# EAGLE schematic Launchpad Board (EAGLE 7.1.0)
CNAME: Bristol Community College; CREVISION: v1r0; DESIGNER: J. Brian
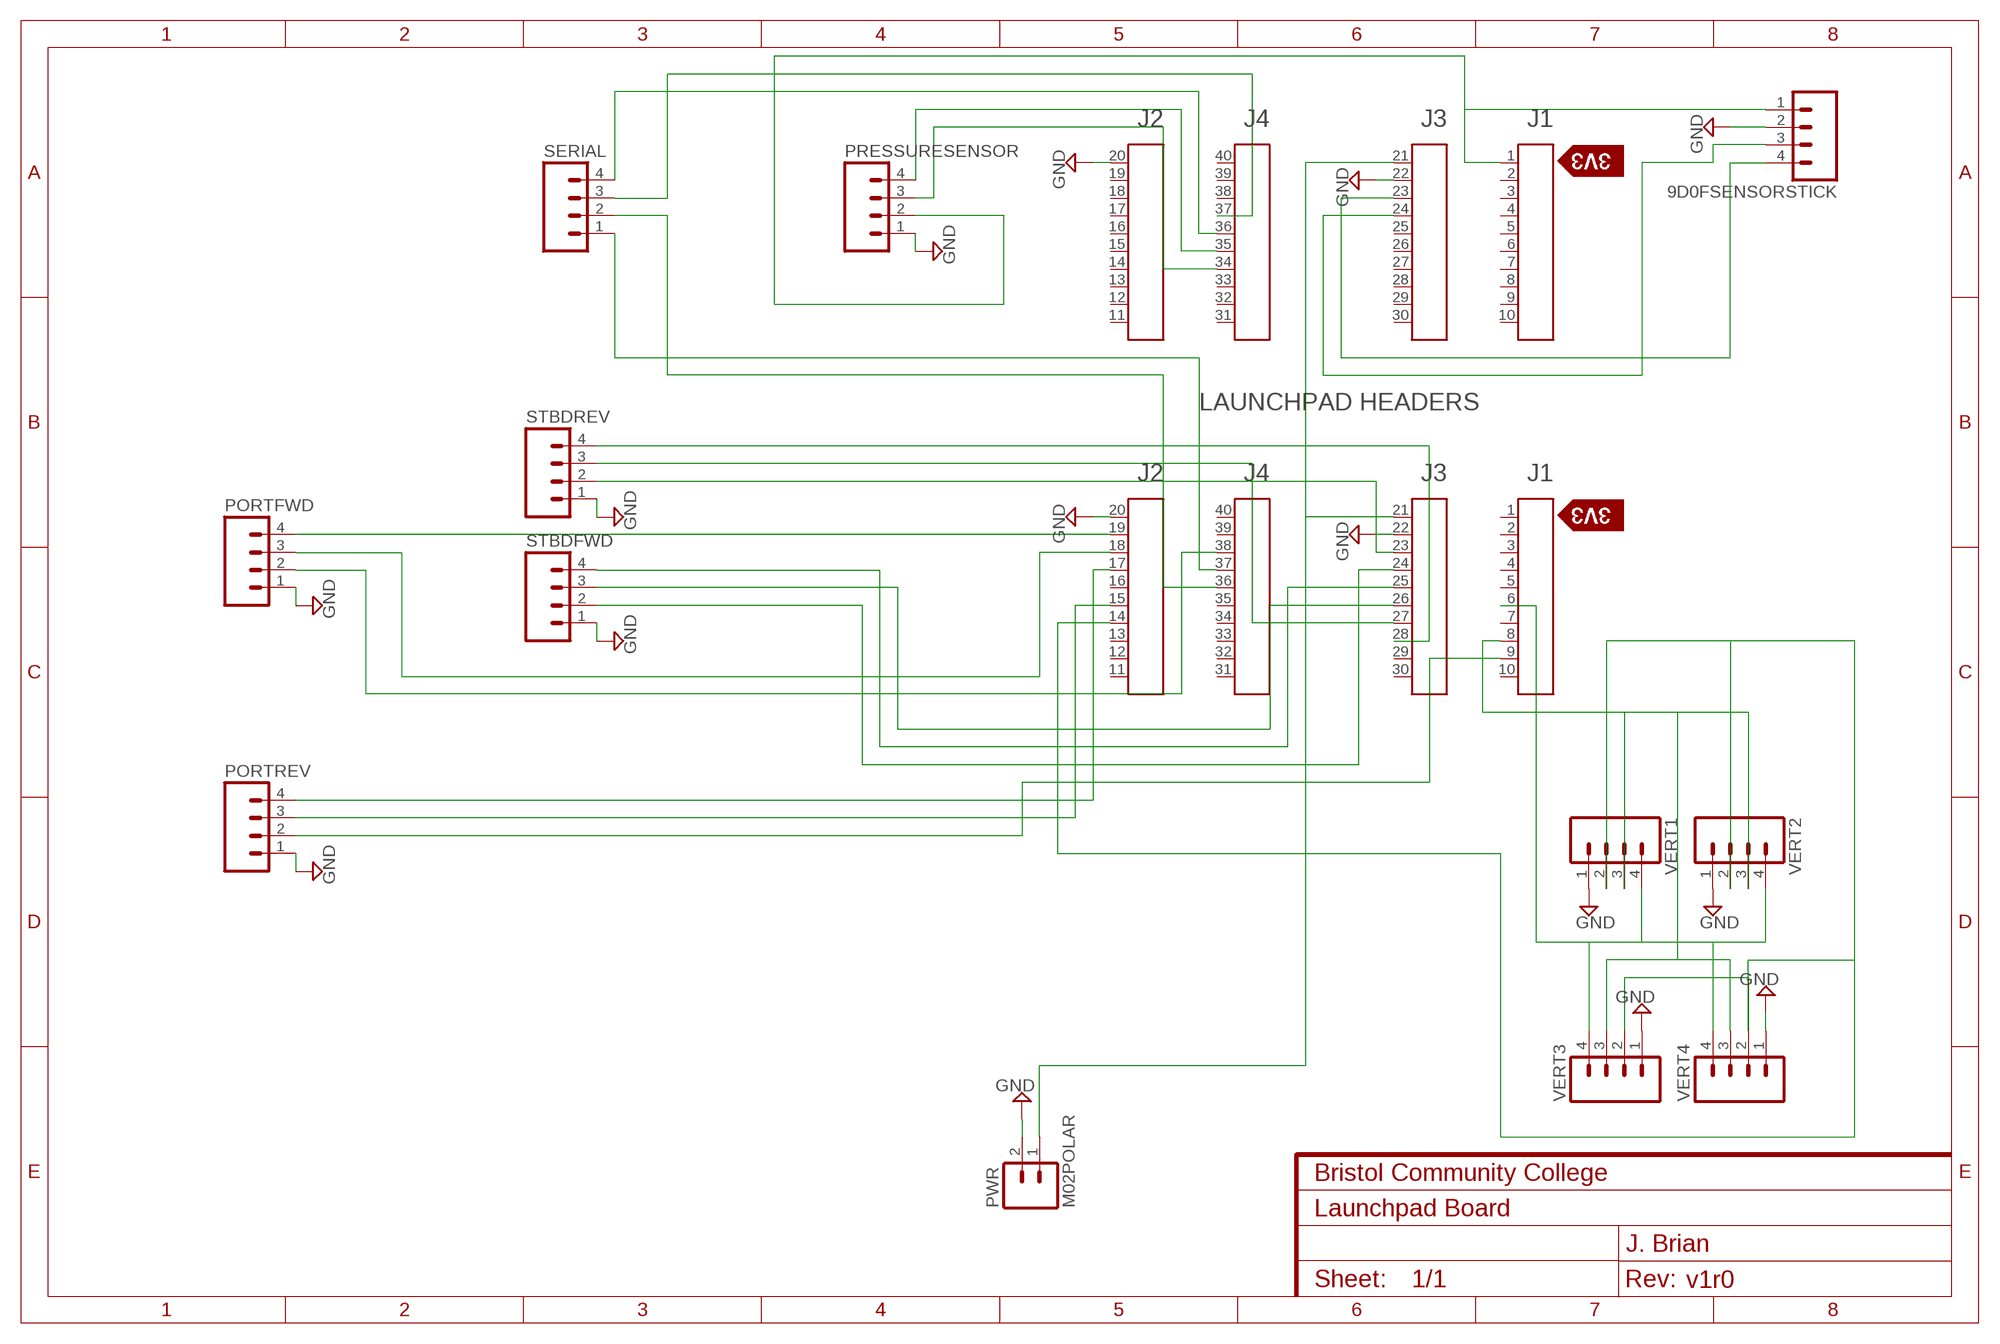
[diagram p0: schematic, sheet 1]

## Parts
9D0FSENSORSTICK  M04PTH  [1X04]
A1  HEADER4X10-BOOSTERPACK  [4X10-BOOSTERPACK]
A2  HEADER4X10-BOOSTERPACK  [4X10-BOOSTERPACK]
PORTFWD  M04POLAR_LOCK  [MOLEX-1X4_LOCK]
PORTREV  M04POLAR_LOCK  [MOLEX-1X4_LOCK]
PRESSURESENSOR  M04POLAR  [MOLEX-1X4]
PWR  M02POLAR  [MOLEX-1X2]
SERIAL  M04POLAR_LOCK  [MOLEX-1X4_LOCK]
STBDFWD  M04POLAR_LOCK  [MOLEX-1X4_LOCK]
STBDREV  M04POLAR_LOCK  [MOLEX-1X4_LOCK]
U$3  SILK_3V3_TAG  [SILK_3V3_TAG]
U$4  SILK_3V3_TAG  [SILK_3V3_TAG]
VERT1  M04POLAR_LOCK  [MOLEX-1X4_LOCK]
VERT2  M04POLAR_LOCK  [MOLEX-1X4_LOCK]
VERT3  M04POLAR_LOCK  [MOLEX-1X4_LOCK]
VERT4  M04POLAR_LOCK  [MOLEX-1X4_LOCK]

## Nets
GND: 9D0FSENSORSTICK.2 A1.20 A1.22 A2.20 A2.22 PORTFWD.1 PORTREV.1 PRESSURESENSOR.1 PWR.2 STBDFWD.1 STBDREV.1 VERT1.1 VERT2.1 VERT3.1 VERT4.1
N$1: A1.21 A2.21 PWR.1
N$2: 9D0FSENSORSTICK.1 A1.1 PRESSURESENSOR.2
N$3: 9D0FSENSORSTICK.3 A1.24
N$5: A2.38 PORTFWD.2
N$6: A2.9 PORTREV.2
N$7: A1.35 PRESSURESENSOR.4
N$8: A2.14 VERT1.2 VERT2.2 VERT3.2 VERT4.2
N$9: A2.8 VERT1.3 VERT2.3 VERT3.3 VERT4.3
N$10: A2.24 STBDFWD.2
N$11: A2.23 STBDREV.2
N$12: A2.25 STBDFWD.4
N$13: A2.6 VERT1.4 VERT2.4 VERT3.4 VERT4.4
N$14: A2.18 PORTFWD.3
N$15: A2.26 STBDFWD.3
N$16: A2.27 STBDREV.3
N$17: A2.28 STBDREV.4
N$18: A2.15 PORTREV.3
N$19: A1.34 PRESSURESENSOR.3
N$20: A2.17 PORTREV.4
N$21: A2.19 PORTFWD.4
N$23: A2.36 SERIAL.2
N$24: A1.36 SERIAL.4
N$25: A1.37 SERIAL.3
N$27: 9D0FSENSORSTICK.4 A1.23
N$32: A2.37 SERIAL.1
Unconnected: A1.2 A1.3 A1.4 A1.5 A1.6 A1.7 A1.8 A1.9 A1.10 A1.11 A1.12 A1.13 A1.14 A1.15 A1.16 A1.17 A1.18 A1.19 A1.25 A1.26 A1.27 A1.28 A1.29 A1.30 A1.31 A1.32 A1.33 A1.38 A1.39 A1.40 A2.1 A2.2 A2.3 A2.4 A2.5 A2.7 A2.10 A2.11 A2.12 A2.13 A2.16 A2.29 A2.30 A2.31 A2.32 A2.33 A2.34 A2.35 A2.39 A2.40

## Notes on the sheet
- LAUNCHPAD HEADERS

## Library data of the parts
9D0FSENSORSTICK PORTFWD PORTREV PRESSURESENSOR SERIAL STBDFWD STBDREV VERT1-VERT4 = SparkFun-Connectors:M04: Header 4 Standard 4-pin 0.1" header. Use with straight break away headers (SKU : PRT-00116), right angle break away headers (PRT-00553), swiss pins (PRT-00743), machine pins (PRT-00117), and female headers (PRT-00115). Molex polarized connector foot print use with SKU : PRT-08231 with associated crimp pins and housings. 1MM SMD Version SKU: PRT-10208
A1 A2 = EAGLE_BoosterPack_Library:HEADER4X10-BOOSTERPACK
PWR = SparkFun-Connectors:M02: Standard 2-pin 0.1" header. Use with - straight break away headers ( PRT-00116) - right angle break away headers (PRT-00553) - swiss pins (PRT-00743) - machine pins (PRT-00117) - female headers (PRT-00115) Molex polarized connector foot print use with: PRT-08233 with associated crimp pins and housings. 2.54_SCREWTERM for use with PRT-10571. 3.5mm Screw Terminal footprints for PRT-08084 5mm Screw Terminal footprints for use with PRT-08433
U$3 U$4 = Public_BP_Library:SILK_3V3_TAG